# Altium schematic sheet Ammeter.SchDoc
size A; SheetNumber: 7; SheetTotal: 8; SPICEModelCacheFFTHAXDY: <root> / <DocumentId>FFTHAXDY</DocumentId> / <CacheFrame Number="0"> / <Model Name="jmk105bj105_v-f" Kind="CKT"> / <Text>* JMK105BJ105_V-F     SPICE MODEL  ( General Type ) / *-------------------------------------------------------------------------------------------------------- / * Model Generated by TAIYO YUDEN Corporation (http://www.ty-top.com) / * Version 1.0 / * TAIYO YUDEN Control No. 170508_130520 / *-------------------------------------------------------------------------------------------------------- / * / * Products Name : Multilayer Ceramic Capacitors / * / * Characteristics : / *     Capacitance : 1 uF , Rated Voltage : 6.3V , TCC : X5R / *     Case Size : 1.0 x 0.5 / 0.039 x 0.02 [mm/inch] , Thickness : 0.5 / 0.02 [mm/inch] / *     (Conditions: Temperature = 25 degC , DC Bias Current/Voltage = 0A / 0V) / * / * Frequency Range : 40Hz - 3GHz / * / * External Node Assignments : / * / *  1  o---| |---o  2 / * / *-------------------------------------------------------------------------------------------------------- / .SubCkt JMK105BJ105_V-F 1 2 / **************************** / C0 1 110 0.63639u / Cm 1 101 0.20521u / C1 101 102 0.32947u / Rc1 101 102 4.3866k / C2 102 103 0.095518u / Rc2 102 103 147.03 / C3 103 110 0.027492u / Rc3 103 110 13.702 / C2m 1 301 0.26441u / C21 301 302 1.8886u / Rc21 301 302 5.8853k / C22 302 303 1.591u / Rc22 302 303 6.0107k / C23 303 304 1.1128u / Rc23 303 304 7.9202k / C24 304 305 0.6027u / Rc24 304 305 330.52 / C25 305 306 0.40375u / Rc25 305 306 352.84 / C26 306 307 0.52396u / Rc26 306 307 8.4799 / C27 307 308 0.86606u / Rc27 307 308 4.7644 / C28 308 309 0.52694u / Rc28 308 309 7.6737 / C29 309 110 1095.2p / Rc29 309 110 0.46166 / Rp0 1 110 100Meg / L0 110 120 0.22207n / Lm 120 130 0.1526n / L1 120 121 0.021807n / RL1 121 130 0.95652 / L2 120 122 0.17379n / RL2 122 130 0.69676 / L3 120 123 0.80256n / RL3 123 130 0.1611 / CR 120 124 0.086847u / LR 124 125 0.095213n / RR 125 130 0.14597 / CL 130 140 2.0214p / LL 130 140 0.14724n / RL 130 140 1.7247k / Rs 140 2 11.702m / **************************** / .ends</Text> / </Model> / </CacheFrame> / </root>
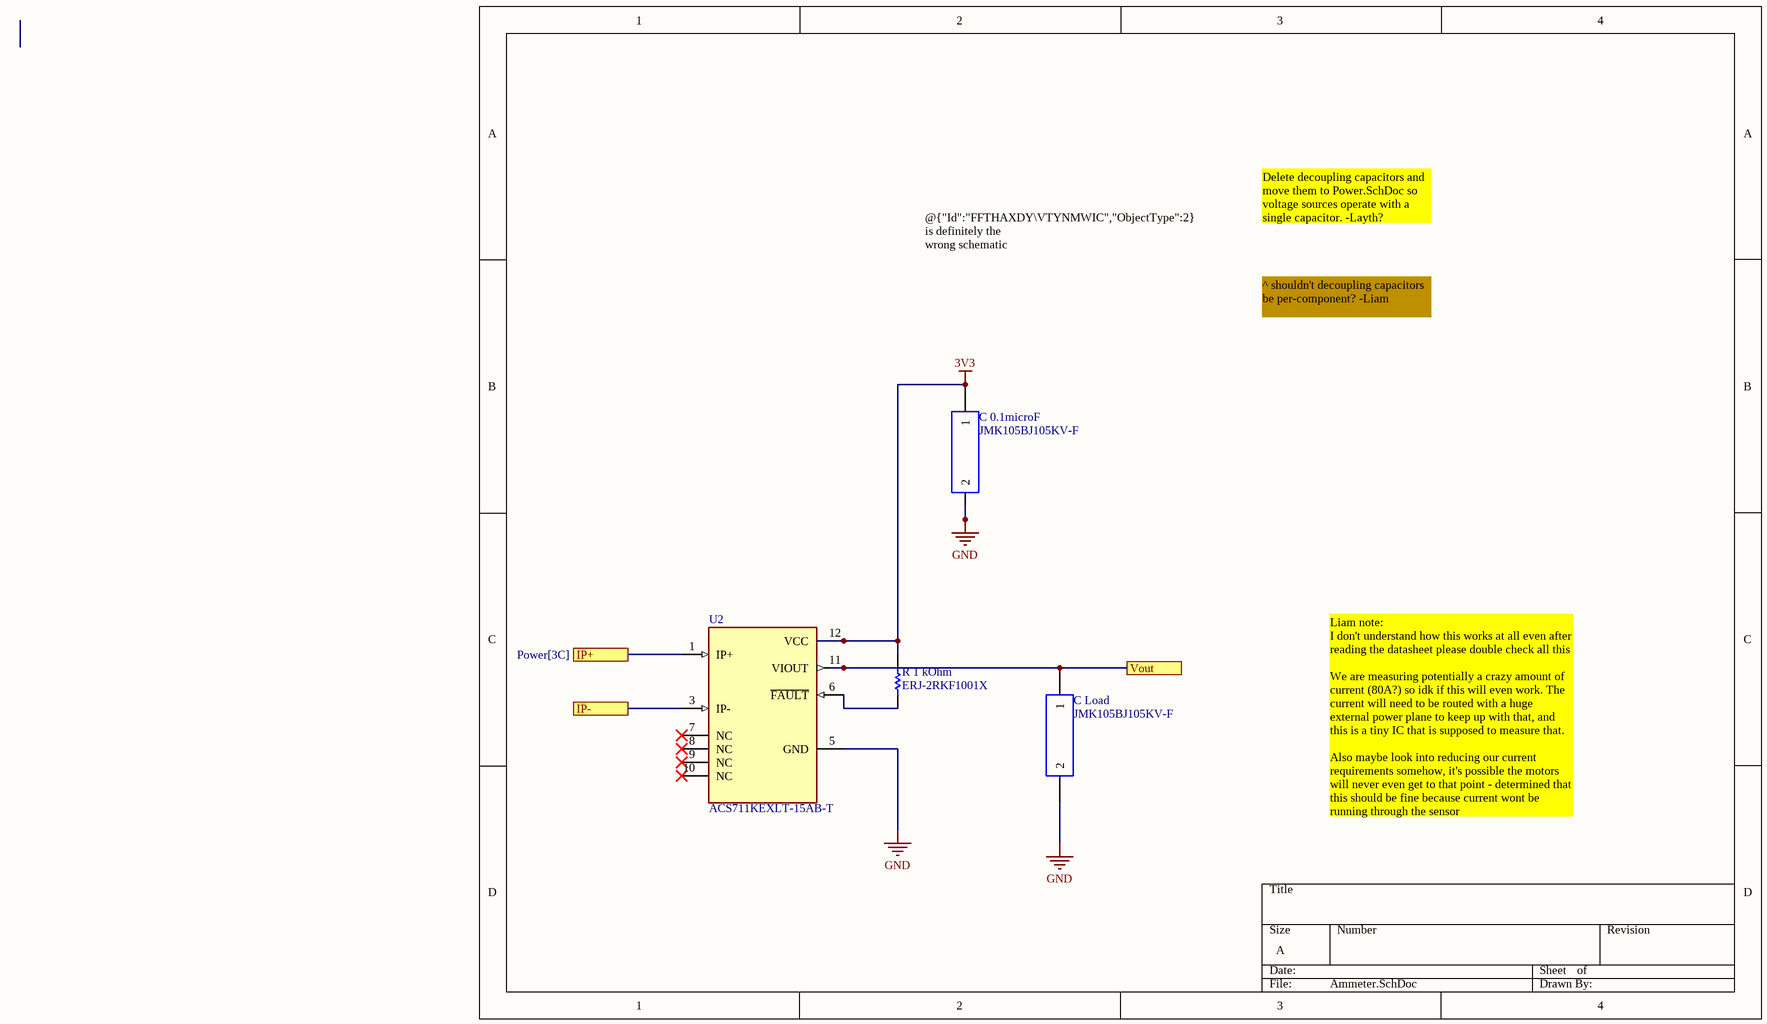
[diagram p0: Ammeter.SchDoc]

## Parts
C_0.1microF  JMK105BJ105KV-F
C_Load  JMK105BJ105KV-F
R_1_kOhm  ERJ-2RKF1001X  [RESC1005X40X25NL05T05]
U2  ACS711KEXLT-15AB-T  [XDCR_ACS711KEXLT-15AB-T]

## Ports
IP+ (see Power[3C]), IP- (see Power[3C]), Vout (see Power[3C])

## Nets
3V3: C_0.1microF.1 R_1_kOhm.2 U2.12(VCC)
GND: C_0.1microF.2 C_Load.2 U2.5(GND)
IP+: U2.1(IP+) ; port IP+
IP-: U2.3(IP-) ; port IP-
Vout: C_Load.1 U2.11(VIOUT) ; port Vout
NetR_1_kOhm_1: R_1_kOhm.1 U2.6(~{FAULT})

Not connected (* = marked no-connect by the designer): U2 7(NC)* 8(NC)* 9(NC)* 10(NC)*

## Notes on the sheet
- Delete decoupling capacitors and move them to Power.SchDoc so voltage sources operate with a single capacitor. -Layth?
- @{"Id":"FFTHAXDY\VTYNMWIC","ObjectType":2} is definitely the wrong schematic
- ^ shouldn't decoupling capacitors be per-component? -Liam
- Liam note:
  I don't understand how this works at all even after reading the datasheet please double check all this
  We are measuring potentially a crazy amount of current (80A?) so idk if this will even work. The current will need to be routed with a huge external power plane to keep up with that, and this is a tiny IC that is supposed to measure that.
  Also maybe look into reducing our current requirements somehow, it's possible the motors will never even get to that point - determined that this should be fine because current wont be running through the sensor

## Library data of the parts
C_0.1microF C_Load = CMP-14477-004050-1: None; Voltage Rating: 6.3V; Dielectric: X5R; Capacitance: 1uF; Tolerance: 10%; Min Operating Temperature: -55°C; Construction: Flat; RoHS Compliant: Yes; Case Code (Imperial): 0402; Mount: Surface Mount; Number of Pins: 2; Termination: SMD/SMT; Series: M; Thickness: 0.022inch; Case Code (Metric): 1005; Packaging: Tape and Reel; Length: 1mm; Resistor Type: Ceramic; Package Quantity: 1; Max Operating Temperature: 85°C; Voltage Rating (DC): 6.3V; Case/Package: 0402; Width: 0.02inch; Lead Free: Lead Free; Radiation Hardening: No; Depth: 0.5mm; Halogen Free: Halogen Free; Height: 0.5mm; REACH SVHC: No SVHC
R_1_kOhm = CMP-1011-00510-4: Chip Resistor, 1 KOhm, +/- 1%, 100 mW, -55 to 155 degC, 0402 (1005 Metric), RoHS, Tape and Reel; Manufacturer: Basic Passives; Voltage Rating: 50 V; Case\/Package: 0402; Resistance: 1 KOhm; Power Rating: 100 mW; PartNumber: ERJ-2RKF1001X; DatasheetVersion: 04/2015; Radiation Hardening: No; Pins: 2; Height: 0.35 mm; RoHSCompliant: true; Case Code (Imperial): 0402; ComponentLink2Description: Datasheet; ComponentLink1Description: Manufacturer URL; PackageReference: 0402; Mount: Surface Mount; Package Quantity: 10000; Tolerance: 1%; ComponentLink1URL: http://www.panasonic.com/; PackageDescription: 2-Pin Surface Mount Device, Body 1 x 0.5 mm; Mounting Technology: Surface Mount; Case Code (Metric): 1005; ComponentLink2URL: http://industrial.panasonic.com/cdbs/www-data/pdf/RDA0000/AOA0000C86.pdf; REACH SVHC: Yes; Packaging: Tape and Reel; Max Operating Temperature: 155 degC; Min Operating Temperature: -55 degC; Width: 0.5 mm; Length: 1 mm
U2 = ACS711KEXLT-15AB-T: Current Sensor 31A 1 Channel Hall Effect, Open Loop Bidirectional 12-PowerWFQFN; MF: Allegro MicroSystems LLC; MP: ACS711KEXLT-31AB-T; Purchase-URL: https://pricing.snapeda.com/search/part/ACS711KEXLT-31AB-T/?ref=eda; Package: QFN-12 Allegro MicroSystems LLC; Value: *; Availability: In Stock; Price: None; SnapEDA_Link: https://www.snapeda.com/parts/ACS711KEXLT-31AB-T/Allegro+MicroSystems+LLC/view-part/?ref=snap; Check_prices: https://www.snapeda.com/parts/ACS711KEXLT-31AB-T/Allegro+MicroSystems+LLC/view-part/?ref=eda